# EAGLE design featherwing-interface (EAGLE 9.6.2)
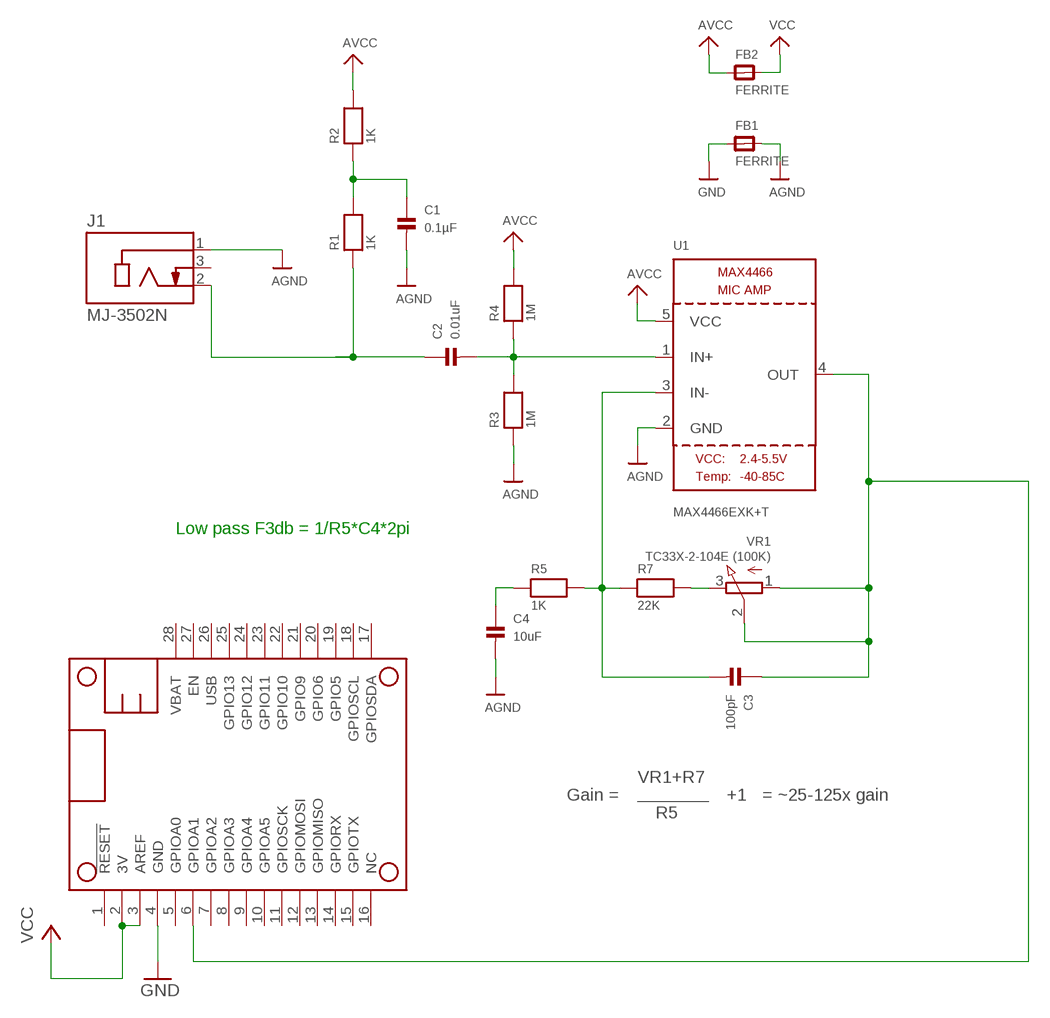
[diagram p0: schematic, sheet 1]

## Parts
C1  0.1µF  CAP_CERAMIC0805  [0805]
C2  0.01uF  CAP_CERAMIC0805  [0805]
C3  100pF  CAP_CERAMIC0805  [0805]
C4  10uF  CAP_CERAMIC0805  [0805]
FB1  FERRITE  FERRITE0805  [0805]
FB2  FERRITE  FERRITE0805  [0805]
J1  MJ-3502N  [CUI_MJ-3502N]
MS1  FEATHERWING  [FEATHERWING]
R1  1K  RESISTOR0805  [0805]
R2  1K  RESISTOR0805  [0805]
R3  1M  RESISTOR0805  [0805]
R4  1M  RESISTOR0805  [0805]
R5  1K  RESISTOR0805  [0805]
R7  22K  RESISTOR0805  [0805]
U1  MAX4466EXK+T  MAX4466""  [SC70-5]
VR1  TC33X-2-104E (100K)  TRIMPOTTC33X-2  [TRIMPOT_BOURNS_TC33X-2]

## Nets
AGND: C1.2 C4.2 FB1.2 J1.1 R3.1 U1.2(GND)
AVCC: FB2.1 R2.2 R4.2 U1.5(VCC)
GND: FB1.1 MS1.4(GND)
N$1: C3.2 R5.2 R7.1 U1.3(IN-)
N$2: R7.2 VR1.3(E)
N$3: C2.1 J1.2 R1.1
N$4: C1.1 R1.2 R2.1
N$5: C2.2 R3.2 R4.1 U1.1(IN+)
N$6: C3.1 MS1.6(GPIOA1) U1.4(OUT) VR1.1(A) VR1.2(S)
N$7: C4.1 R5.1
VCC: FB2.2 MS1.2(3V) MS1.3(AREF)
Unconnected: J1.3 MS1.1(!RESET) MS1.5(GPIOA0) MS1.7(GPIOA2) MS1.8(GPIOA3) MS1.9(GPIOA4) MS1.10(GPIOA5) MS1.11(GPIOSCK) MS1.12(GPIOMOSI) MS1.13(GPIOMISO) MS1.14(GPIORX) MS1.15(GPIOTX) MS1.16(NC) MS1.17(GPIOSDA) MS1.18(GPIOSCL) MS1.19(GPIO5) MS1.20(GPIO6) MS1.21(GPIO9) MS1.22(GPIO10) MS1.23(GPIO11) MS1.24(GPIO12) MS1.25(GPIO13) MS1.26(USB) MS1.27(EN) MS1.28(VBAT)

## Notes on the sheet
- Low pass F3db = 1/R5*C4*2pi
- VR1+R7
- Gain = | +1 | = ~25-125x gain
- R5

## Library data of the parts
C1-C4 = microbuilder:CAP_CERAMIC: Ceramic Capacitors 0402 - 0402 Surface Mount Capacitors 16pF 50V 5% [Digikey: 445-4899-2-ND] 18pF 50V 5% [Digikey: 490-1281-2-ND] 22pF 50V 5% [Digikey: 490-1283-2-ND] 68pF 50V 5% [Digikey: 490-1289-2-ND] 0.1uF 10V 10% [Digikey: 490-1318-2-ND] 1.0uF 6.3V 10% [Digikey: 490-1320-2-ND] 0603 - 0603 Surface Mount Capacitors 16 pF 50V 5% [Digikey: 445-5051-2-ND] 22 pF 50V [Digikey: PCC220ACVTR-ND] 33 pF 50V 5% [Digikey: 490-1415-1-ND] 56pF 50V 5% [Digikey: 490-1421-1-ND] 220pF 50V 5% [Digikey: 445-1285-1-ND] 680 pF 50V 2200 pF 50V 5% C0G [Digikey: 445-1297-1-ND] 5600 pF 100V 5% X7R [Digikey: 478-3711-1-ND] 0.1 µF 25V 10% [Digikey: PCC2277TR-ND] 0.22 µF 16V 10% X7R [Digikey: 445-1318-1-ND] 1.0 µF 25V 10% [Digikey: 445-5146-2-ND] 0603 - RF Specific 3pF 250V +/-0.1pF RF [Digikey: 712-1347-1-ND] 18 pF 250V 5% [Digikey: 478-3505-1-ND or 712-1322-1-ND] 56 pF 250V 5% C0G RF [Digikey: 490-4867-1-ND] 68 pF 250V RF [Digikey: 490-4868-1-ND] 0805 - 0805 Surface Mount Capacitors 220 pF 250V 2% RF Ceramic Capacitor [Digikey: 712-1398-1-ND] 1000 pF 50V 2% NP0 Ceramic Capacitor [Digikey: 478-3760-1-ND] 0.1 µF 25V 10% Ceramic Capacitor [Digikey: PCC1828TR-ND] 1.0 µF 16V 10% Ceramic Capacitor[Digikey: 490-1691-2-ND] 10.0 µF 10V 10% Ceramic Capacitor[Digikey: 709-1228-1-ND] 10.0 uF 16V 10% Ceramic Capacitor [Digikey: 478-5165-2-ND] 47 uF 6.3V 20% Ceramic Capacitor [Digikey: 587-1779-1-ND or 399-5506-1-ND] 1206 - 1206 Surface Mount Capacitors 47uF 10V 20% Ceramic Capacitor [Digikey: 490-5528-1-ND or 399-5508-1-ND or 445-6010-1-ND] 100uF 6.3V -20%, +80% Y5V Ceramic Capacitor (Digikey: 490-4512-1-ND, Mouser: 81-GRM31CF50J107ZE1L)
FB1 FB2 = microbuilder:FERRITE: Ferrite Bead 0603 MMZ1608B121C - 120 Ohm @ 100MHz, 600mA, 0.15 Ohm DC Resistance - Digikey: 445-2164-1-ND BK1608HW121-T - 120 Ohm, 600mA Ferrite Chip - Digikey: 587-1876-2-ND 0805 HZ0805B272R-10 - 2.7K Ohm @ 100MHz, 200mA, 0.8 Ohm DC Resistance - Digikey: 240-2504-1-ND (see also Murata BLM21BD272SN1L) MMZ2012Y152B - 1.5K Ohm @ 100MHz, 500mA, 0.4 Ohm DC Resistance - Digikey: 445-1560-1-ND - Mainly for high frequency (80-400MHz) MMZ2012R102A - 1K Ohm @ 100MHz, 500mA, 0.3 Ohm DC Resistance - Digikey: 445-1555-2-ND - More general purpose (10-200MHz)
J1 = MJ-3502N:MJ-3502N: 3.5 mm, Mono, Right Angle, Through Hole, Audio Jack Connector; MANUFACTURER: CUI INC; PART_REV: A; STANDARD: MANUFACTURER RECOMMENDATIONS
MS1 = adafruit:FEATHERWING
R1-R5 R7 = microbuilder:RESISTOR: Resistors 0402 - 0402 Surface Mount Package 22 Ohm 1% 1/16W [Digikey: 311-22.0LRTR-ND] 33 Ohm 5% 1/16W 1.0K 5% 1/16W 1.5K 5% 1/16W 2.0K 1% 1/16W 10.0K 1% 1/16W [Digikey: 311-10.0KLRTR-ND] 10.0K 5% 1/16W [Digikey: RMCF0402JT10K0TR-ND] 12.1K 1% 1/16W [Digikey: 311-22.0LRTR-ND] 100.0K 5% 1/16W 0603 - 0603 Surface Mount Package 0 Ohm 1/10 Watt 1% Resistor 15 Ohm 1/10 Watt 1% Resistor 33 Ohm 1/10 Watt 1% Resistor 49.9 Ohm 1/10 Watt 1% Resistor 100 Ohm 1/10 Watt 1% Resistor 150 Ohm 1/10 Watt 1% Resistor 240 Ohm 1/10 Watt 1% Resistor 390 Ohm 1/10 Watt 1% Resistor 560 Ohm 1/10 Watt 1% Resistor 680 Ohm 1/10 Watt 1% Resistor 750 Ohm 1/10 Watt 1% Resistor 1.0K Ohm 1/10 Watt 1% Resistor 1.5K Ohm 1/10 Watt 1% Resistor 2.0K Ohm 1/10 Watt 1% Resistor 2.2K Ohm 1/10 Watt 1% Resistor 3.3K Ohm 1/10 Watt 1% Resistor 4.7K Ohm 1/10 Watt 1% Resistor 10.0K Ohm 1/10 Watt 1% Resistor 12.0K Ohm 1/10 Watt 1% Resistor 12.1K Ohm 1/10 Watt 1% Resistor 20.0K Ohm 1/10 Watt 1% Resistor 33.0K Ohm 1/10 Watt 1% Resistor 100.0K Ohm 1/10 Watt 1% Resistor 0805 - 0805 Surface Mount Package 0 Ohm 1/8 Watt 1% Resistor 33 Ohm 1/8 Watt 1% Resistor 100 Ohm 1/8 Watt 1% Resistor 150 Ohm 1/8 Watt 1% Resistor 200 Ohm 1/8 Watt 1% Resistor 240 Ohm 1/8 Watt 1% Resistor 330 Ohm 1/8 Watt 1% Resistor 390 Ohm 1/8 Watt 1% Resistor 470 Ohm 1/8 Watt 1% Resistor 1.0K Ohm 1/8 Watt 1% Resistor 1.5K Ohm 1/8 Watt 1% Resistor 2.0K Ohm 1/8 Watt 1% Resistor 4.7K Ohm 1/8 Watt 1% Resistor 5.1K Ohm 1/8 Watt 1% Resistor 5.6K Ohm 1/8 Watt 1% Resistor 10.0K Ohm 1/8 Watt 1% Resistor 22.0K Ohm 1/8 Watt 1% Resistor 33.0K Ohm 1/8 Watt 1% Resistor 100K Ohm 1/8 Watt 1% Resistor 1206 - 1206 Surface Mount Package 2012 - 2010 Surface Mount Package 0.11 Ohm 1/2 Watt 1% Resistor - Digikey: RHM.11UCT-ND
U1 = microbuilder:MAX4466: MAX4466 - Microphone Pre-Amp
VR1 = microbuilder:TRIMPOT: 3-Pin SMT Trimpots Bourns TC33 (X-2) Series 10K - Digikey: TC33X-2-103E 100K - Digikey: TC33X-104ECT-ND Bourns 3303 (W) Series 3mm 10K Single Turn - Digikey: 3303W-103ETR-ND 3mm 100K Single Turn - Digikey: 3303X-104ETR-ND

## Board
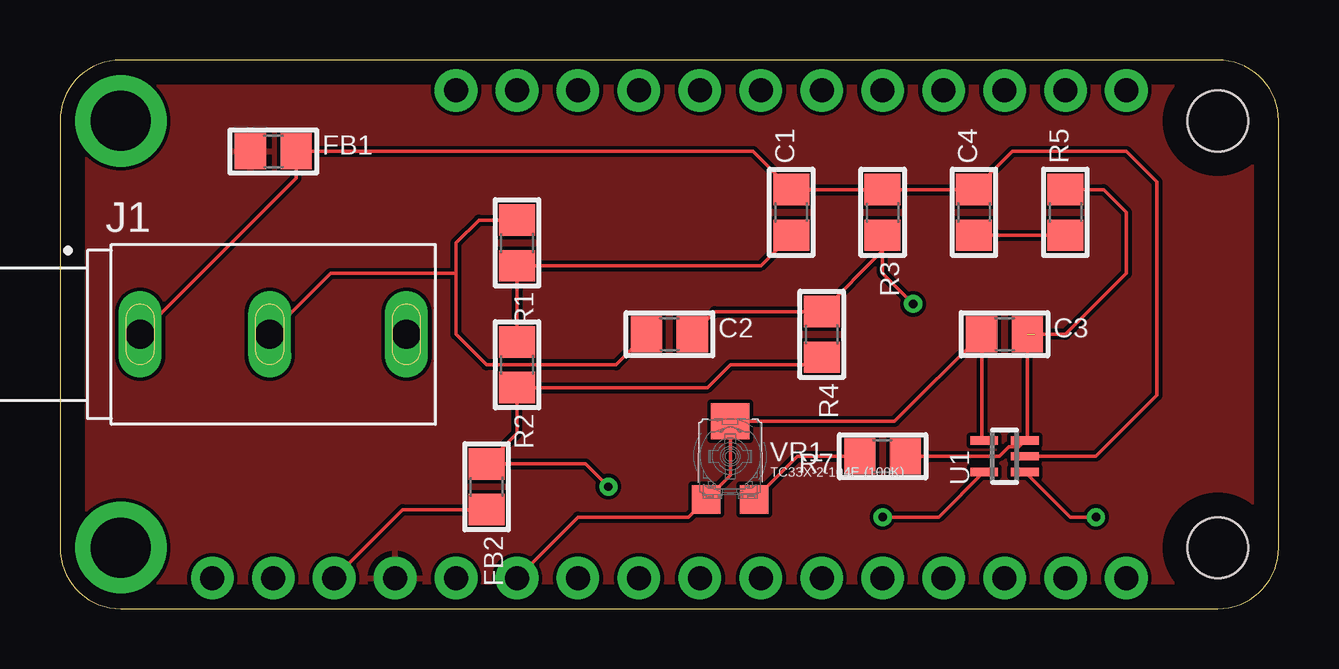
[diagram p1: board, top side]
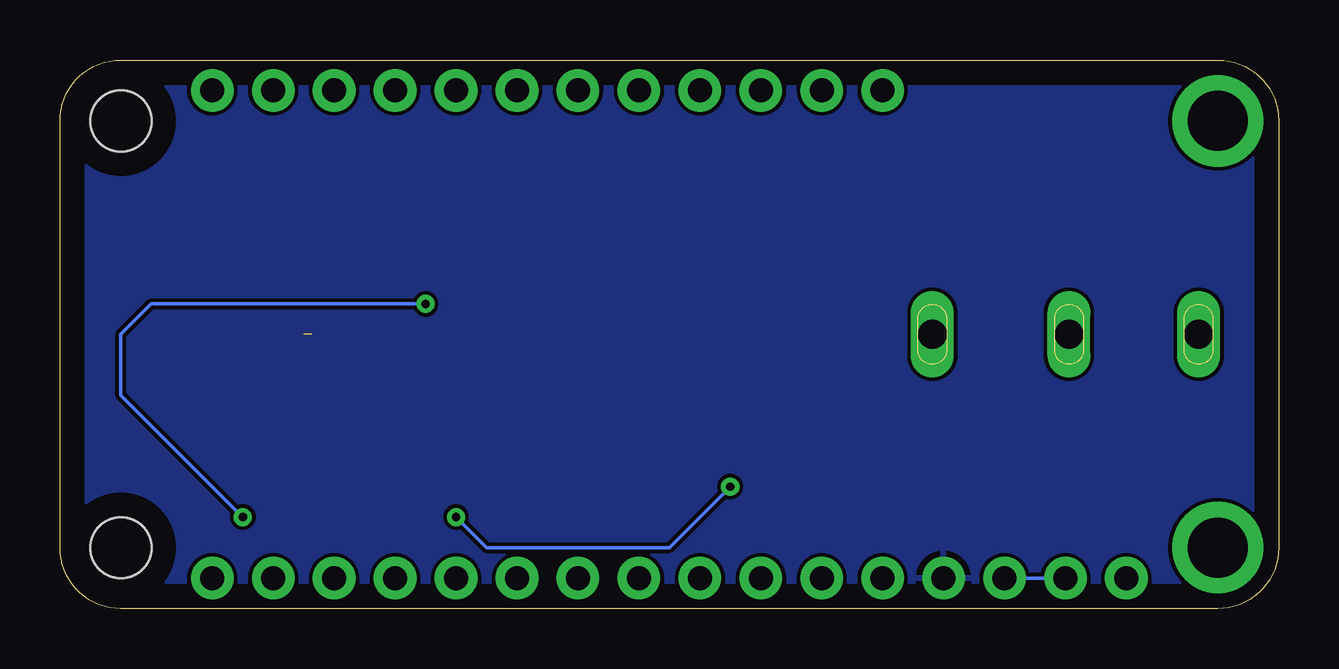
[diagram p2: board, bottom side, seen from below]

Size 50.8 x 22.86 mm. Coordinates in mm from the lower left corner, seen from the top.
Copper layers (1*16): Top 0.035mm / dielectric 1.5mm / Bottom 0.035mm
Design rules "default": minimum track width 6mil, minimum drill 0.35mm, track to track 6mil, track to pad 6mil, pad to pad 6mil, via to via 6mil, smd to smd 6mil, copper to edge 40mil, drill to drill 6mil, minimum pad ring 10mil, minimum via ring 8mil, stop-mask expansion 4mil, vias tented up to drill 0mil, thermal gap 10mil

### Footprints (pad centres in the part's own frame; a part is rotated, then mirrored left to right if it is on the bottom)
0805 = smd 1.3 x 1.5: 1 -0.95,0; 2 0.95,0
CUI_MJ-3502N = drill 1.2 long: 1 -5.55,0; 2 -0.15,0; 3 5.55,0
FEATHERWING = drill 1 pad 1.778: 1 6.35,1.27; 2 8.89,1.27; 3 11.43,1.27; 4 13.97,1.27; 5 16.51,1.27; 6 19.05,1.27; 7 21.59,1.27; 8 24.13,1.27; 9 26.67,1.27; 10 29.21,1.27; 11 31.75,1.27; 12 34.29,1.27; 13 36.83,1.27; 14 39.37,1.27; 15 41.91,1.27; 16 44.45,1.27; 17 44.45,21.59; 18 41.91,21.59; 19 39.37,21.59; 20 36.83,21.59; 21 34.29,21.59; 22 31.75,21.59; 23 29.21,21.59; 24 26.67,21.59; 25 24.13,21.59; 26 21.59,21.59; 27 19.05,21.59; 28 16.51,21.59 | drill 2.5 pad 3.81: P$1 2.54,20.32; P$2 2.54,2.54 | hole 2.54: 48.26,20.32; 48.26,2.54
SC70-5 = smd 0.35 x 1.15: 1 -0.65,-0.85; 2 0,-0.85; 3 0.65,-0.85; 4 0.65,0.85; 5 -0.65,0.85
TRIMPOT_BOURNS_TC33X-2 = smd 1.2 x 1.2: 1 -1,-1.8; 3 1,-1.8 | smd 1.6 x 1.5: 2 0,1.45

### Placement (x,y rotation side)
C1  30.48,16.51 90 top
C2  25.4,11.43 0 top
C3  39.37,11.43 0 top
C4  38.1,16.51 90 top
FB1  8.89,19.05 0 top
FB2  17.78,5.08 270 top
J1  8.89,11.43 0 top
MS1  0,0 0 top
R1  19.05,15.24 270 top
R2  19.05,10.16 270 top
R3  34.29,16.51 270 top
R4  31.75,11.43 270 top
R5  41.91,16.51 90 top
R7  34.29,6.35 180 top
U1  39.37,6.35 90 top
VR1  27.94,6.35 0 top

### Tracks (layer width: path | path; a pad name or v marks a point on that pad's centre or on a via)
AGND
  Top 0.152: 30.8,17.78 C1.2 | J1.1 9.84,17.93 FB1.2 28.89,19.05 C1.2 | C1.2 R3.1 C4.2 39.69,19.05 44.45,19.05 45.72,17.78 45.72,8.89 43.18,6.35 U1.2
AVCC  (via drill 0.35)
  Top 0.152: R4.2 31.43,10.16 27.94,10.16 26.99,9.21 R2.2 19.05,7.3 FB2.1 21.91,6.03 v22.86,5.08 | U1.5 36.63,3.81 v34.29,3.81
  Bottom 0.152: v34.29,3.81 33.02,2.54 25.4,2.54 v22.86,5.08
GND
  pour Top (isolate 0): 0,22.86 0,0 50.8,0 50.8,22.86
  pour Bottom (isolate 0): 0,22.86 0,0 50.8,0 50.8,22.86
N$1  (1 unrouted)
  Top 0.152: R7.1 39.15,6.35 39.55,6.75 39.97,6.75 U1.3 40.32,7.1 C3.2 | R5.2 43.5,17.46 44.45,16.51 44.45,13.97 41.91,11.43 40.64,11.43
N$2
  Top 0.152: VR1.3 30.74,6.35 R7.2
N$3
  Top 0.152: C2.1 23.18,10.16 17.78,10.16 16.51,11.43 16.51,13.97 | 16.51,13.97 16.51,15.24 17.46,16.19 R1.1 | J1.2 11.28,13.97 16.51,13.97
N$4
  Top 0.152: R2.1 R1.2 29.21,14.29 C1.1
N$5  (via drill 0.35)
  Top 0.152: C2.2 27.3,12.38 R4.1 34.29,14.92 | 34.29,14.92 R3.2 | U1.1 42.11,3.81 v43.18,3.81 | v35.56,12.7 34.29,13.97 34.29,14.92
  Bottom 0.152: v43.18,3.81 48.26,8.89 48.26,11.43 46.99,12.7 v35.56,12.7
N$6
  Top 0.152: VR1.2 27.94,7.62 | U1.4 38.42,7.1 C3.1 34.79,7.8 VR1.2 | MS1.6 21.59,3.81 26.2,3.81 26.44,4.05 VR1.1 27.94,5.55 VR1.2
N$7
  Top 0.152: C4.1 R5.1
VCC
  Top 0.152: MS1.3 14.29,4.13 FB2.2
  Bottom 0.152: MS1.2 MS1.3